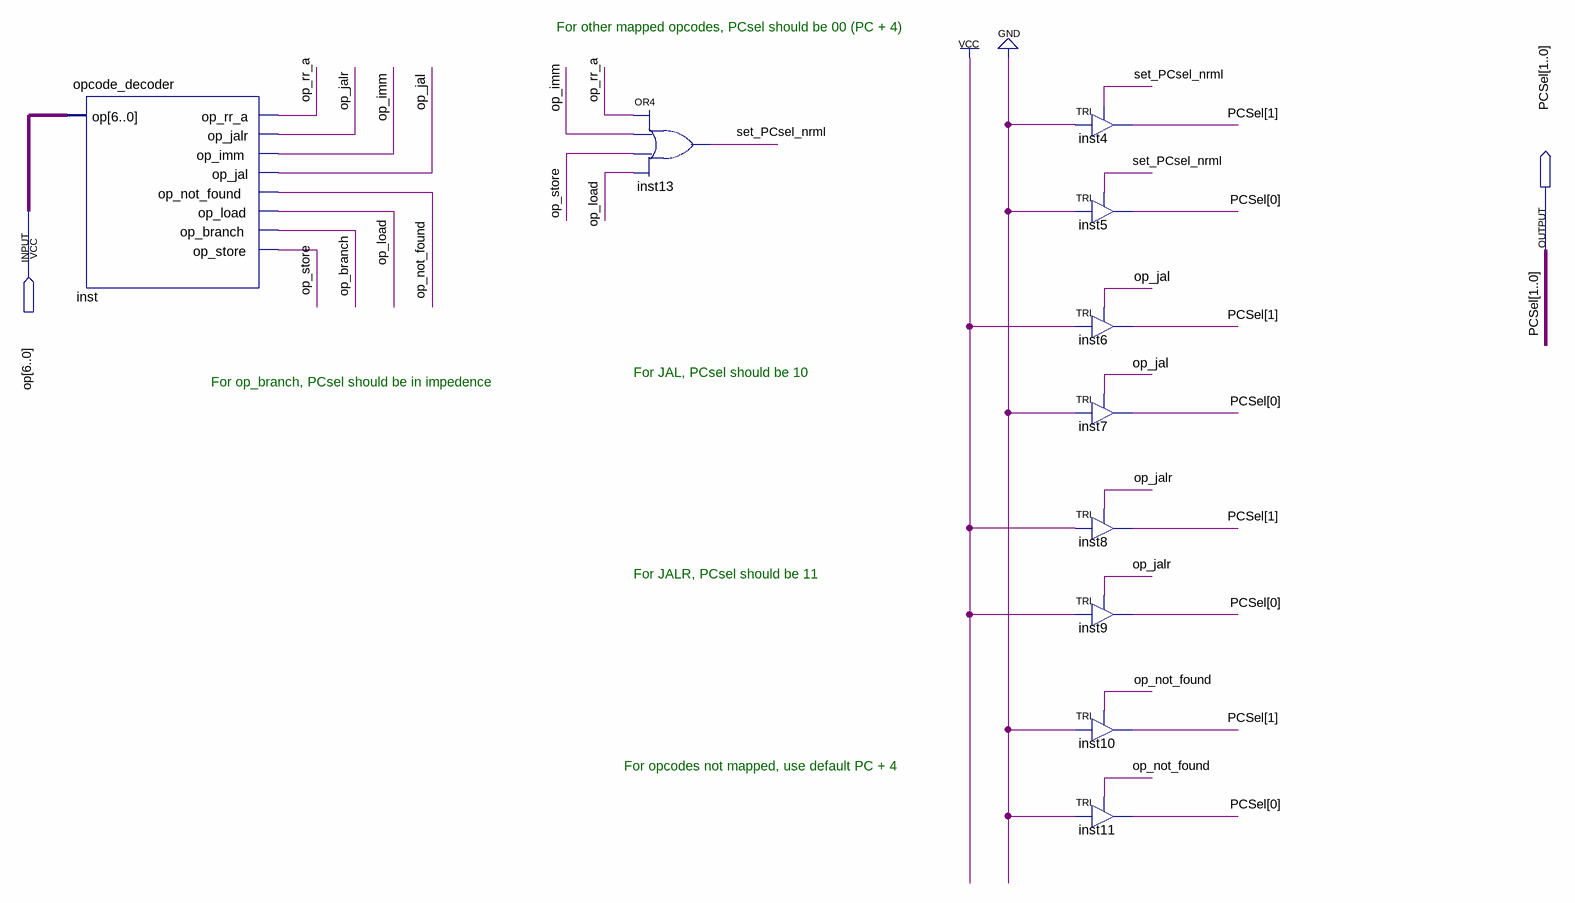
[diagram p0: schematic sheet]
// Quartus schematic PCSel_setter.bdf as structural Verilog: 10 symbols, 2 pins
module PCSel_setter (
  input  [6:0] op,
  output [1:0] PCSel
);

  wire op_branch, op_imm, op_jal, op_jalr, op_load, op_not_found, op_rr_a, op_store, set_PCsel_nrml;

  opcode_decoder inst (
    .op(op), .op_rr_a(op_rr_a), .op_jalr(op_jalr), .op_imm(op_imm), .op_jal(op_jal),
    .op_not_found(op_not_found), .op_load(op_load), .op_branch(op_branch), .op_store(op_store));
  or inst13 (set_PCsel_nrml, op_rr_a, op_imm, op_store, op_load);
  TRI inst4 (.IN(1'b0), .OE(set_PCsel_nrml), .OUT(PCSel[1]));
  TRI inst5 (.IN(1'b0), .OE(set_PCsel_nrml), .OUT(PCSel[0]));
  TRI inst6 (.IN(1'b1), .OE(op_jal), .OUT(PCSel[1]));
  TRI inst7 (.IN(1'b0), .OE(op_jal), .OUT(PCSel[0]));
  TRI inst8 (.IN(1'b1), .OE(op_jalr), .OUT(PCSel[1]));
  TRI inst9 (.IN(1'b1), .OE(op_jalr), .OUT(PCSel[0]));
  TRI inst10 (.IN(1'b0), .OE(op_not_found), .OUT(PCSel[1]));
  TRI inst11 (.IN(1'b0), .OE(op_not_found), .OUT(PCSel[0]));

  // Notes on the sheet:
  //   For other mapped opcodes, PCsel should be 00 (PC + 4)
  //   For JAL, PCsel should be 10
  //   For op_branch, PCsel should be in impedence
  //   For JALR, PCsel should be 11
  //   For opcodes not mapped, use default PC + 4
endmodule
